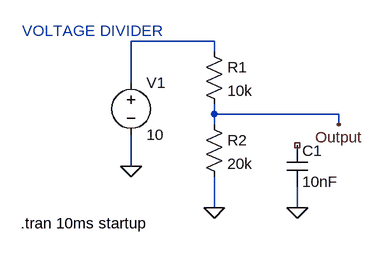
[diagram p0: schematic Draft1.asc]
Draft1.asc, the LTspice schematic file:
Version 4
SHEET 1 880 680
WIRE 144 32 16 32
WIRE 144 48 144 32
WIRE 16 96 16 32
WIRE 144 144 144 128
WIRE 336 144 144 144
WIRE 144 160 144 144
WIRE 336 160 336 144
WIRE 16 224 16 176
WIRE 144 288 144 240
WIRE 272 288 272 256
FLAG 16 224 0
FLAG 144 288 0
FLAG 336 160 Output
FLAG 272 288 0
SYMBOL res 128 32 R0
SYMATTR InstName R1
SYMATTR Value 10k
SYMBOL res 128 144 R0
SYMATTR InstName R2
SYMATTR Value 20k
SYMBOL voltage 16 80 R0
WINDOW 123 0 0 Left 0
WINDOW 39 0 0 Left 0
SYMATTR InstName V1
SYMATTR Value 10
SYMBOL cap 256 192 R0
SYMATTR InstName C1
SYMATTR Value 10nF
TEXT -152 16 Left 2 ;VOLTAGE DIVIDER
TEXT -154 312 Left 2 !.tran 10ms startup

The netlist it stands for:
* Draft1.asc
R1 N001 Output 10k
R2 Output 0 20k
V1 N001 0 10
C1 NC_01 0 10nF
* VOLTAGE DIVIDER
.tran 10ms startup
.backanno
.end